# Altium project ControlBoard.PrjPCB
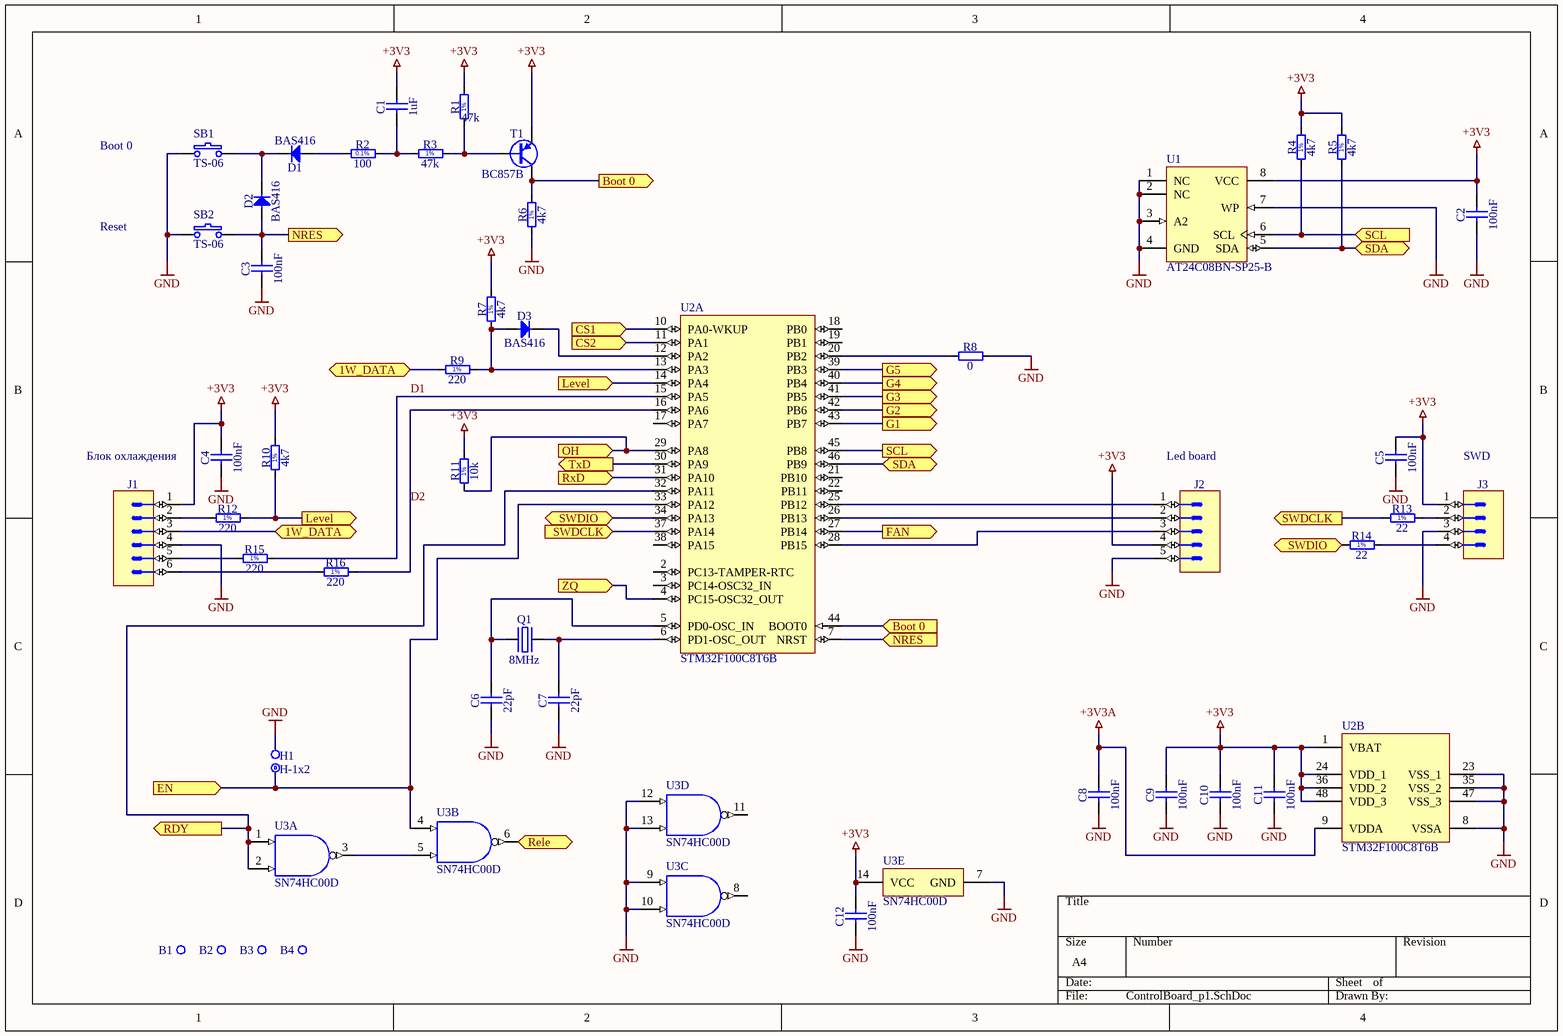
[diagram p0: ControlBoard_p1.SchDoc]
2 sheets, 117 parts. Net scope: flat (ports and power ports of the same name join across sheets).
Board file: PM_CPUBoard_pcb.PcbDoc
Sheets:
  ControlBoard_p1.SchDoc
  ControlBoard_p2.SchDoc

## Sheet ControlBoard_p1.SchDoc
size A4

### Parts
B1  Plated Hole  [MTG350_650]  (value not drawn)
B2  Plated Hole  [MTG350_650]  (value not drawn)
B3  Plated Hole  [MTG350_650]  (value not drawn)
B4  Plated Hole  [MTG350_650]  (value not drawn)
C1  1uF  [CAPC2012X140N]
C2  100nF  [CAPC2012X135N]
C3  100nF  [CAPC2012X135N]
C4  100nF  [CAPC2012X135N]
C5  100nF  [CAPC2012X135N]
C6  22pF  [CAPC2012X135N]
C7  22pF  [CAPC2012X135N]
C8  100nF  [CAPC2012X135N]
C9  100nF  [CAPC2012X135N]
C10  100nF  [CAPC2012X135N]
C11  100nF  [CAPC2012X135N]
C12  100nF  [CAPC2012X135N]
D1  BAS416  [SOD2512X110N]
D2  BAS416  [SOD2512X110N]
D3  BAS416  [SOD2512X110N]
H1  H-1x2  [J1x2]
J1  KK®  [MOLEX_22-27-2061]  (value not drawn)
J2  KK®  [MOLEX_22-27-2051]  (value not drawn)
J3  KK®  [MOLEX_22-27-2041]  (value not drawn)
Q1  8MHz  [XTAL_HC-49/U-S]
R1  47k  [RESC2012X60N]
R2  100  [RESC2012X60N]
R3  47k  [RESC2012X60N]
R4  4k7  [RESC2012X60N]
R5  4k7  [RESC2012X60N]
R6  4k7  [RESC2012X60N]
R7  4k7  [RESC2012X60N]
R8  0  [RESC2012X60N]
R9  220  [RESC2012X60N]
R10  4k7  [RESC2012X60N]
R11  10k  [RESC2012X60N]
R12  220  [RESC2012X60N]
R13  22  [RESC2012X60N]
R14  22  [RESC2012X60N]
R15  220  [RESC2012X60N]
R16  220  [RESC2012X60N]
SB1  TS-06  [TS-06]
SB2  TS-06  [TS-06]
T1  BC857B  [SOT95P230X110-3N]
U1  AT24C08BN-SP25-B  [8S1_N]
U2  STM32F100C8T6B  [STM-LQFP48_N]  (parts A,B of 2)
U3  SN74HC00D  [D0014A_N]  (parts A,B,C,D,E of 5)

### Ports
1W_DATA (bidir), Boot 0 (in), Boot 0 (out), CS1 (in), CS2 (in), EN (in), FAN (out), G1 (out), G2 (out), G3 (out), G4 (out), G5 (out), Level (in), Level (out), NRES (in), NRES (out), OH (in), RDY (out), Rele (out), RxD (in), SCL (in), SCL (out), SDA (bidir), SWDCLK (in), SWDCLK (out), SWDIO (bidir), TxD (out), ZQ (in)

### Nets
+3V3: C1.2 C2.2 C4.2 C5.2 C9.2 C10.2 C11.2 C12.2 J1.1 J2.4 J3.1 R1.2 R4.2 R5.2 R7.2 R10.2 R11.2 T1.2(E) U1.8(VCC) U2.1(VBAT) U2.24(VDD_1) U2.36(VDD_2) U2.48(VDD_3) U3.14(VCC)
+3V3A: C8.2 U2.9(VDDA)
GND: C2.1 C3.1 C4.1 C5.1 C6.1 C7.1 C8.1 C9.1 C10.1 C11.1 C12.1 H1.2 J1.4 J2.5 J3.3 R6.1 R8.2 SB1.1 SB2.1 U1.1(NC) U1.2(NC) U1.3(A2) U1.4(GND) U1.7(WP) U2.8(VSSA) U2.23(VSS_1) U2.35(VSS_2) U2.47(VSS_3) U3.7(GND) U3.9(3A) U3.10(3B) U3.12(4A) U3.13(4B)
D1: R15.2 U2.15(PA5)
D2: R16.2 U2.16(PA6)
NetC1_1: C1.1 R2.2 R3.1
NetC3_2: C3.2 D2.2(A) SB2.2 U2.7(NRST) ; port NRES
NetC6_2: C6.2 Q1.1(OSC1) U2.5(PD0-OSC_IN)
NetC7_2: C7.2 Q1.2(OSC2) U2.6(PD1-OSC_OUT)
NetC25_2: U2.11(PA1) ; port CS2
NetC26_2: U2.10(PA0-WKUP) ; port CS1
NetC29_2: U2.31(PA10) ; port RxD
NetC29_3: U2.30(PA9) ; port TxD
NetD1_1: D1.1(C) D2.1(C) SB1.2
NetD1_2: D1.2(A) R2.1
NetD3_1: D3.1(C) U2.12(PA2)
NetD3_2: D3.2(A) R7.1 R9.2 U2.13(PA3)
NetDA1_4: H1.1 U2.33(PA12) U3.4(2A) ; port EN
NetIC2_5: U2.4(PC15-OSC32_OUT) ; port ZQ
NetJ1_2: J1.2 R12.1
NetJ1_3: J1.3 R9.1 ; port 1W_DATA
NetJ1_5: J1.5 R15.1
NetJ1_6: J1.6 R16.1
NetJ2_1: J2.1 U2.25(PB12)
NetJ2_2: J2.2 U2.26(PB13)
NetJ2_3: J2.3 U2.28(PB15)
NetJ3_2: J3.2 R13.2
NetJ3_4: J3.4 R14.2
NetJ4_8: R11.1 U2.29(PA8) ; port OH
NetLD1_2: U2.43(PB7) ; port G1
NetLD2_2: U2.42(PB6) ; port G2
NetLD3_2: U2.41(PB5) ; port G3
NetLD4_2: U2.40(PB4) ; port G4
NetLD5_2: U2.39(PB3) ; port G5
NetR1_1: R1.1 R3.2 T1.1(B)
NetR4_1: R4.1 U1.6(SCL) U2.45(PB8) ; port SCL
NetR5_1: R5.1 U1.5(SDA) U2.46(PB9) ; port SDA
NetR6_2: R6.2 T1.3(C) U2.44(BOOT0) ; port Boot 0
NetR8_1: R8.1 U2.20(PB2)
NetR10_1: R10.1 R12.2 U2.14(PA4) ; port Level
NetR13_1: R13.1 U2.37(PA14) ; port SWDCLK
NetR14_1: R14.1 U2.34(PA13) ; port SWDIO
NetR22_2: U2.27(PB14) ; port FAN
NetR23_2: U3.6(2Y) ; port Rele
NetR39_2: U2.32(PA11) U3.1(1A) U3.2(1B) ; port RDY
NetU3_3: U3.3(1Y) U3.5(2B)

Not connected (* = marked no-connect by the designer): B1 1; B2 1; B3 1; B4 1; U2 2(PC13-TAMPER-RTC) 3(PC14-OSC32_IN) 17(PA7) 18(PB0) 19(PB1) 21(PB10) 22(PB11) 38(PA15); U3 8(3Y) 11(4Y)

### Notes on the sheet
- Boot 0
- Reset
- Блок охлаждения
- (near J2) Led board
- (near J3) SWD
- (in symbol R0805_4K7_1%_0.125W_100PPM) 1%
- (in symbol R0805_10K_1%_0.125W_100PPM) 1%
- (in symbol R0805_22R_1%_0.125W_100PPM) 1%
- (in symbol R0805_47K_1%_0.125W_100PPM) 1%
- (in symbol R0805_100R_0.1%_0.1W_10PPM) 0.1%
- (in symbol R0805_220R_1%_0.125W_100PPM) 1%

### Library data of the parts
B1-B4 = PLATED_HOLE3.5_PAD6.5: Single Terminal Socket; Part Description: Plated Through Hole: Hole Dia.=3.5mm Pad Dia.=6.5mm; Mounted: No; Table: Pads; Part Number: PLATED_HOLE3.5_PAD6.5; Component Kind: Standard (No BOM); Component Type: Standard (No BOM); Pin Count: 1; Family: Plated Hole; Socket: No; SMD: No; Status: None; ComponentHeight: 0mm; Author: CERN DEM JLC; CreateDate: 20.11.2008; LatestRevisionDate: 23.11.2011; PackageDescription: Plated Through Hole: Hole Dia.=3.5mm Pad Dia.=6.5mm
C1 = CC0805_1UF_35V_20%_X7R: Non-polarised capacitor; Part Description: SMD Multilayer Chip Ceramic Capacitor; Manufacturer: GENERIC; Manufacturer1 Part Number: GMK212B7105MG-T; Voltage: 35V; TC: X7R; Tolerance: ±20%; Table: Capacitors SMD; Part Number: CC0805_1UF_35V_20%_X7R; Component Kind: Standard; Component Type: Standard; Pin Count: 2; Value: 1uF; Status: Not Recommended; Manufacturer Part Number: CC0805_1UF_35V_20%_X7R; Case: 0805; Mounted: Yes; Socket: No; SMD: Yes; Manufacturer1 Example: TAIYO YUDEN; Manufacturer1 ComponentHeight: 1.35mm; HelpURL: \\cern.ch\dfs\Applications\Altium\Datasheets\CC0805_X7R_TAIYO-YUDEN_HIGH-VALUE.pdf; Author: CERN DEM JLC; CreateDate: 22.06.2011; LatestRevisionDate: 22.06.2011
C2-C5 C8-C12 = CC0805_100NF_50V_10%_X7R: Non-polarised capacitor; Part Description: SMD Multilayer Chip Ceramic Capacitor; Manufacturer: GENERIC; Manufacturer1 Part Number: B37941K5104K62; Voltage: 50V; TC: X7R; Tolerance: ±10%; Table: Capacitors SMD; Part Number: CC0805_100NF_50V_10%_X7R; Component Kind: Standard; Component Type: Standard; Pin Count: 2; Value: 100nF; Status: Preferred; Manufacturer Part Number: CC0805_100NF_50V_10%_X7R; Case: 0805; Mounted: Yes; Socket: No; SMD: Yes; Manufacturer1 Example: EPCOS; Manufacturer1 ComponentHeight: 1.35mm; HelpURL: \\cern.ch\dfs\Applications\Altium\Datasheets\CC0805_X7R_EPCOS.pdf; Author: CERN DEM JLC; CreateDate: 03.12.2007; LatestRevisionDate: 03.12.2007
C6 C7 = CC0805_22PF_50V_5%_NP0: Non-polarised capacitor; Part Description: SMD Multilayer Chip Ceramic Capacitor; Manufacturer: GENERIC; Manufacturer1 Part Number: 223886115229; Voltage: 50V; TC: NP0; Tolerance: ±5%; Table: Capacitors SMD; Part Number: CC0805_22PF_50V_5%_NP0; Component Kind: Standard; Component Type: Standard; Pin Count: 2; Value: 22pF; Status: Preferred; Manufacturer Part Number: CC0805_22PF_50V_5%_NP0; Case: 0805; Mounted: Yes; Socket: No; SMD: Yes; Manufacturer1 Example: PHYCOMP; Manufacturer1 ComponentHeight: 1.35mm; HelpURL: \\cern.ch\dfs\Applications\Altium\Datasheets\CC0805_NP0_PHYCOMP.pdf; Author: CERN DEM JLC; CreateDate: 03.12.2007; LatestRevisionDate: 03.12.2007
D1-D3 = BAS416: Diode; Part Description: Low-Leakage Diode; Manufacturer: NXP SEMICONDUCTORS; Voltage: 75V; Power: 200mA; Table: Diodes; Part Number: BAS416; Component Kind: Standard; Component Type: Standard; Device: BAS416; PackageDescription: Small Outline Diode Flat Lead (SOD-323), 1.70mm W X 1.25mm L X 1.10mm H body,  IPC Medium Density; Manufacturer Part Number: BAS416; Pin Count: 2; Case: SOD323; Mounted: Yes; Socket: No; SMD: Yes; ComponentHeight: 1.1mm; HelpURL: \\cern.ch\dfs\Applications\Altium\Datasheets\BAS416.pdf; Author: CERN DEM JLC; CreateDate: 01.10.2013; LatestRevisionDate: 01.10.2013
J1 = MOLEX_22-27-2061: Connector 6 Male; Part Description: 2.54mm (.100") Pitch KK® Wire-to-Board Header, Vertical, with Friction Lock, 6 Circuits, Tin (Sn) Plating; Manufacturer: MOLEX; Part Number: MOLEX_22-27-2061; Component Kind: Standard; Component Type: Standard; Pin Count: 6; Family: KK®; Mounted: Yes; Socket: No; SMD: No; Status: None; Manufacturer Part Number: 22-27-2061; ComponentHeight: 11.7mm; HelpURL: \\cern.ch\dfs\Applications\Altium\Datasheets\MOLEX_22-27-2061.pdf; Author: CERN DEM JMW; CreateDate: 30.11.2011; LatestRevisionDate: 30.11.2011; Table: MOLEX
J2 = MOLEX_22-27-2051: Connector 5 Male; Part Description: 2.54mm (.100") Pitch KK® Wire-to-Board Header, Vertical, with Friction Lock, 5 Circuits, Tin (Sn) Plating; Manufacturer: MOLEX; Part Number: MOLEX_22-27-2051; Component Kind: Standard; Component Type: Standard; Pin Count: 5; Family: KK®; Mounted: Yes; Socket: No; SMD: No; Status: None; Manufacturer Part Number: 22-27-2051; ComponentHeight: 11.7mm; HelpURL: \\cern.ch\dfs\Applications\Altium\Datasheets\MOLEX_22-27-2051.pdf; Author: CERN DEM JLC; CreateDate: 04.12.2008; LatestRevisionDate: 04.12.2008; Table: MOLEX
J3 = MOLEX_22-27-2041: Connector 4 Male; Part Description: 2.54mm (.100") Pitch KK® Wire-to-Board Header, Vertical, with Friction Lock, 4 Circuits, Tin (Sn) Plating; Manufacturer: MOLEX; Part Number: MOLEX_22-27-2041; Component Kind: Standard; Component Type: Standard; Pin Count: 4; Family: KK®; Mounted: Yes; Socket: No; SMD: No; Status: None; Manufacturer Part Number: 22-27-2041; ComponentHeight: 11.7mm; HelpURL: \\cern.ch\dfs\Applications\Altium\Datasheets\MOLEX_22-27-2041.pdf; Author: CERN DEM JLC; CreateDate: 04.12.2008; LatestRevisionDate: 04.12.2008; Table: MOLEX
Q1 = XTAL_5MHZ_CITIZEN_HC49US5.000MABJ-UB: Quartz Crystal; Part Description: Tolerance:± 30ppm, Stability:± 50ppm, -10°C to +60°C, 18pF, Quartz Crystal, HC-49/U-S Serie; Manufacturer: CITIZEN FINETECH MIYOTA CO; Table: Crystals & Oscillators; Part Number: XTAL_5MHZ_CITIZEN_HC49US5.000MABJ-UB; Component Kind: Standard; Component Type: Standard; PackageDescription: HC-49/U-S Leaded Cristal, Body 11.5x4.66mm; Pitch 4.88mm; Value: 8MHz; Manufacturer Part Number: HC49US5.000MABJ-UB; Pin Count: 2; Mounted: Yes; Socket: No; SMD: No; ComponentHeight: 3.5mm; HelpURL: \\cern.ch\dfs\Applications\Altium\Datasheets\XTAL_CITIZEN_HC-49-U-S.pdf; Author: CERN DEM JLC; CreateDate: 27.11.2012; LatestRevisionDate: 27.11.2012
R1 R3 = R0805_47K_1%_0.125W_100PPM: Resistor - 1%; Part Description: General Purpose Thick Film Chip Resistor; Manufacturer: GENERIC; Manufacturer1 Part Number: NRC10F4702TRF; Power: 0.125W; TC: ±100ppm/°C; Table: Resistors SMD; Part Number: R0805_47K_1%_0.125W_100PPM; Component Kind: Standard; Component Type: Standard; Pin Count: 2; Value: 47k; Status: Preferred; Tolerance: ±1%; Manufacturer Part Number: R0805_47K_1%_0.125W_100PPM; Case: 0805; Mounted: Yes; Socket: No; SMD: Yes; Manufacturer1 Example: NIC COMPONENT; Manufacturer1 ComponentHeight: 0.6mm; HelpURL: \\cern.ch\dfs\Applications\Altium\Datasheets\R0805_NIC_NRC.pdf; Author: CERN DEM JLC; CreateDate: 03.12.2007; LatestRevisionDate: 13.03.2008
R2 = R0805_100R_0.1%_0.1W_10PPM: Resistor - 0.1%; Part Description: Thin Film Chip Resistor; Manufacturer: GENERIC; Manufacturer1 Part Number: RN73C2A100RBTG; Power: 0.1W; TC: ±10ppm; Table: Resistors SMD; Part Number: R0805_100R_0.1%_0.1W_10PPM; Component Kind: Standard; Component Type: Standard; Pin Count: 2; Value: 100; Status: Not recommended; Tolerance: ±0.1%; Manufacturer Part Number: R0805_100R_0.1%_0.1W_10PPM; Case: 0805; Mounted: Yes; Socket: No; SMD: Yes; Manufacturer1 Example: TYCO HOLSWORTHY; Manufacturer1 ComponentHeight: 0.6mm; HelpURL: \\cern.ch\dfs\Applications\Altium\Datasheets\R0805_Tyco_RN73.pdf; Author: CERN DEM JLC; CreateDate: 03.12.2007; LatestRevisionDate: 13.03.2008
R4-R7 R10 = R0805_4K7_1%_0.125W_100PPM: Resistor - 1%; Part Description: General Purpose Thick Film Chip Resistor; Manufacturer: GENERIC; Manufacturer1 Part Number: NRC10F4701TRF; Power: 0.125W; TC: ±100ppm/°C; Table: Resistors SMD; Part Number: R0805_4K7_1%_0.125W_100PPM; Component Kind: Standard; Component Type: Standard; Pin Count: 2; Value: 4k7; Status: Preferred; Tolerance: ±1%; Manufacturer Part Number: R0805_4K7_1%_0.125W_100PPM; Case: 0805; Mounted: Yes; Socket: No; SMD: Yes; Manufacturer1 Example: NIC COMPONENT; Manufacturer1 ComponentHeight: 0.6mm; HelpURL: \\cern.ch\dfs\Applications\Altium\Datasheets\R0805_NIC_NRC.pdf; Author: CERN DEM JLC; CreateDate: 03.12.2007; LatestRevisionDate: 13.03.2008
R8 = R0805_0R_JUMPER: Resistor; Part Description: 2A (0.05R Max DC Resistance) Zero Ohm Jumper; Manufacturer: GENERIC; Manufacturer1 Part Number: NRC10Z0; Table: Resistors SMD; Part Number: R0805_0R_JUMPER; Component Kind: Standard; Component Type: Standard; Pin Count: 2; Value: 0; Status: Preferred; Manufacturer Part Number: R0805_0R_JUMPER; Case: 0805; Mounted: Yes; Socket: No; SMD: Yes; Manufacturer1 Example: NIC COMPONENT; Manufacturer1 ComponentHeight: 0.6mm; HelpURL: \\cern.ch\dfs\Applications\Altium\Datasheets\R0805_NIC_NRC.pdf; Author: CERN DEM JLC; CreateDate: 03.12.2007; LatestRevisionDate: 13.03.2008
R9 R12 R15 R16 = R0805_220R_1%_0.125W_100PPM: Resistor - 1%; Part Description: General Purpose Thick Film Chip Resistor; Manufacturer: GENERIC; Manufacturer1 Part Number: NRC10F2200TRF; Power: 0.125W; TC: ±100ppm/°C; Table: Resistors SMD; Part Number: R0805_220R_1%_0.125W_100PPM; Component Kind: Standard; Component Type: Standard; Pin Count: 2; Value: 220; Status: Preferred; Tolerance: ±1%; Manufacturer Part Number: R0805_220R_1%_0.125W_100PPM; Case: 0805; Mounted: Yes; Socket: No; SMD: Yes; Manufacturer1 Example: NIC COMPONENT; Manufacturer1 ComponentHeight: 0.6mm; HelpURL: \\cern.ch\dfs\Applications\Altium\Datasheets\R0805_NIC_NRC.pdf; Author: CERN DEM JLC; CreateDate: 03.12.2007; LatestRevisionDate: 13.03.2008
R11 = R0805_10K_1%_0.125W_100PPM: Resistor - 1%; Part Description: General Purpose Thick Film Chip Resistor; Manufacturer: GENERIC; Manufacturer1 Part Number: NRC10F1002TRF; Power: 0.125W; TC: ±100ppm/°C; Table: Resistors SMD; Part Number: R0805_10K_1%_0.125W_100PPM; Component Kind: Standard; Component Type: Standard; Pin Count: 2; Value: 10k; Status: Preferred; Tolerance: ±1%; Manufacturer Part Number: R0805_10K_1%_0.125W_100PPM; Case: 0805; Mounted: Yes; Socket: No; SMD: Yes; Manufacturer1 Example: NIC COMPONENT; Manufacturer1 ComponentHeight: 0.6mm; HelpURL: \\cern.ch\dfs\Applications\Altium\Datasheets\R0805_NIC_NRC.pdf; Author: CERN DEM JLC; CreateDate: 03.12.2007; LatestRevisionDate: 13.03.2008
R13 R14 = R0805_22R_1%_0.125W_100PPM: Resistor - 1%; Part Description: General Purpose Thick Film Chip Resistor; Manufacturer: GENERIC; Manufacturer1 Part Number: NRC10F22R0TRF; Power: 0.125W; TC: ±100ppm/°C; Table: Resistors SMD; Part Number: R0805_22R_1%_0.125W_100PPM; Component Kind: Standard; Component Type: Standard; Pin Count: 2; Value: 22; Status: Preferred; Tolerance: ±1%; Manufacturer Part Number: R0805_22R_1%_0.125W_100PPM; Case: 0805; Mounted: Yes; Socket: No; SMD: Yes; Manufacturer1 Example: NIC COMPONENT; Manufacturer1 ComponentHeight: 0.6mm; HelpURL: \\cern.ch\dfs\Applications\Altium\Datasheets\R0805_NIC_NRC.pdf; Author: CERN DEM JLC; CreateDate: 03.12.2007; LatestRevisionDate: 13.03.2008
SB1 SB2 = Buton TS-06: Price: 0.15
T1 = BC857B: PNP Transistor; Part Description: 45V 100mA PNP general-purpose transistors; Manufacturer: NXP SEMICONDUCTORS; Table: Transistors; Part Number: BC857B; Component Kind: Standard; Component Type: Standard; Device: BC857B; PackageDescription: SOT23, 3 pin, Pitch 0.95mm - 1.3mm W X 2.9mm L X 1.1mm H, IPC Medium Density; Manufacturer Part Number: BC857B; Pin Count: 3; Case: SOT23-3; Mounted: Yes; Socket: No; SMD: Yes; ComponentHeight: 1.1mm; HelpURL: \\cern.ch\dfs\Applications\Altium\Datasheets\BC857B.pdf; Author: CERN DEM JLC; CreateDate: 14.06.2011; LatestRevisionDate: 14.06.2011
U1 = AT24C08BN-SP25-B: 8Kbit (1024 x 8), 2-wire Bus Automotive Serial EEPROM with Write Protect, 2.5V, 8-Pin SOIC, Bulk; DatasheetVersion: 8517C,  Jan-2009; PackageVersion: revC, Mar-2005; PackageReference: 8S1; PackageDescription: 8-Lead (0.150" Wide Body), Plastic Gull Wing Small Outline (JEDEC SOIC); Code_JEDEC: MS-012-AA; Code_IPC: SOIC127P600-8; ComponentLink1Description: Manufacturer URL; ComponentLink1URL: http://www.atmel.com/; ComponentLink2Description: Datasheet; ComponentLink2URL: http://www.atmel.com/dyn/resources/prod_documents/doc8517.pdf
U2 = STM32F100C8T6B: ARM Cortex-M3 32-bit MCU, 64 KB Flash, 8 KB Internal RAM, 37 I/Os, 48-pin LQFP, -40 to 85 degC, Tray; A/D Converter: 1x12-bit (10 Channel); D/A Converter: 2x12-bit (2 Channel); FLASH Size (Prog) (kB): 64; I/Os (High Current): 37; Internal RAM Size (kB): 8; Operating Frequency(F) (Processor speed) (MHz): 24; Supply Voltage(Vcc) min (V): 2; DatasheetVersion: Rev. 7; PackageVersion: Rev. 6, 06/2013; PackageReference: LQFP48; PackageDescription: 48-Pin Low Profile Quad Flat Package, 7 x 7 mm Body, 0.5 mm Pitch; Supplier 1: Digi-Key; Supplier Part Number 1: 497-10499-ND; Supplier 2: Farnell; Supplier Part Number 2: 1838511; Supplier 3: Newark; Supplier Part Number 3: 76R0988; Supplier 4: Mouser; Supplier Part Number 4: 511-STM32F100C8T6B; Core: ARM Cortex-M3; Packing: Tray; Mounting Technology: Surface Mount; PartNumber: STM32F100C8T6B; ComponentLink1Description: Manufacturer URL; ComponentLink1URL: http://www.st.com/web/en/home.html; ComponentLink2Description: Datasheet; ComponentLink2URL: http://www.st.com/st-web-ui/static/active/en/resource/technical/document/datasheet/CD00251732.pdf; ComponentLink3Description: Package Specification; ComponentLink3URL: http://www.st.com/st-web-ui/static/active/en/resource/technical/document/datasheet/DM00058181.pdf
U3 = SN74HC00D: Quad 2-Input Positive-NAND Gates, D0014A, TUBE; Manufacturer: Texas Instruments; VCC(Min)(V): 2; VCC(Max)(V): 6; Output Type: CMOS; ICC @ Nom Voltage(Max)(mA): 0.02; Bits(#): 4; F @ Nom Voltage(Max)(Mhz): 70; Rating: Catalog; Technology Family: HC; Voltage(Nom)(V): 5; Schmitt Trigger: Yes; Output Drive (IOL/IOH)(Max)(mA): 5.2/-5.2; tpd @ Nom Voltage(Max)(ns): 23; DatasheetVersion: SCLS181E; PackageReference: D0014A; Supplier 1: Mouser; Supplier Part Number 1: 595-SN74HC00D; Supplier 2: Digi-Key; Supplier Part Number 2: 296-1187-5-ND; Generic Part Number: SN74HC00; Input Type: CMOS; Operating Temperature Range(C): -40 to 85; Code_JEDEC: MS-012; PartNumber: SN74HC00D; ComponentLink1Description: Manufacturer URL; ComponentLink1URL: http://www.ti.com/; ComponentLink2Description: Datasheet; ComponentLink2URL: http://www.ti.com/lit/ds/symlink/sn74hc00.pdf; ComponentLink3Description: Package Specification; ComponentLink3URL: http://www.ti.com/lit/ml/mpds177g/mpds177g.pdf
H1 = H-1x2: Price: 0.02

## Sheet ControlBoard_p2.SchDoc
size A4
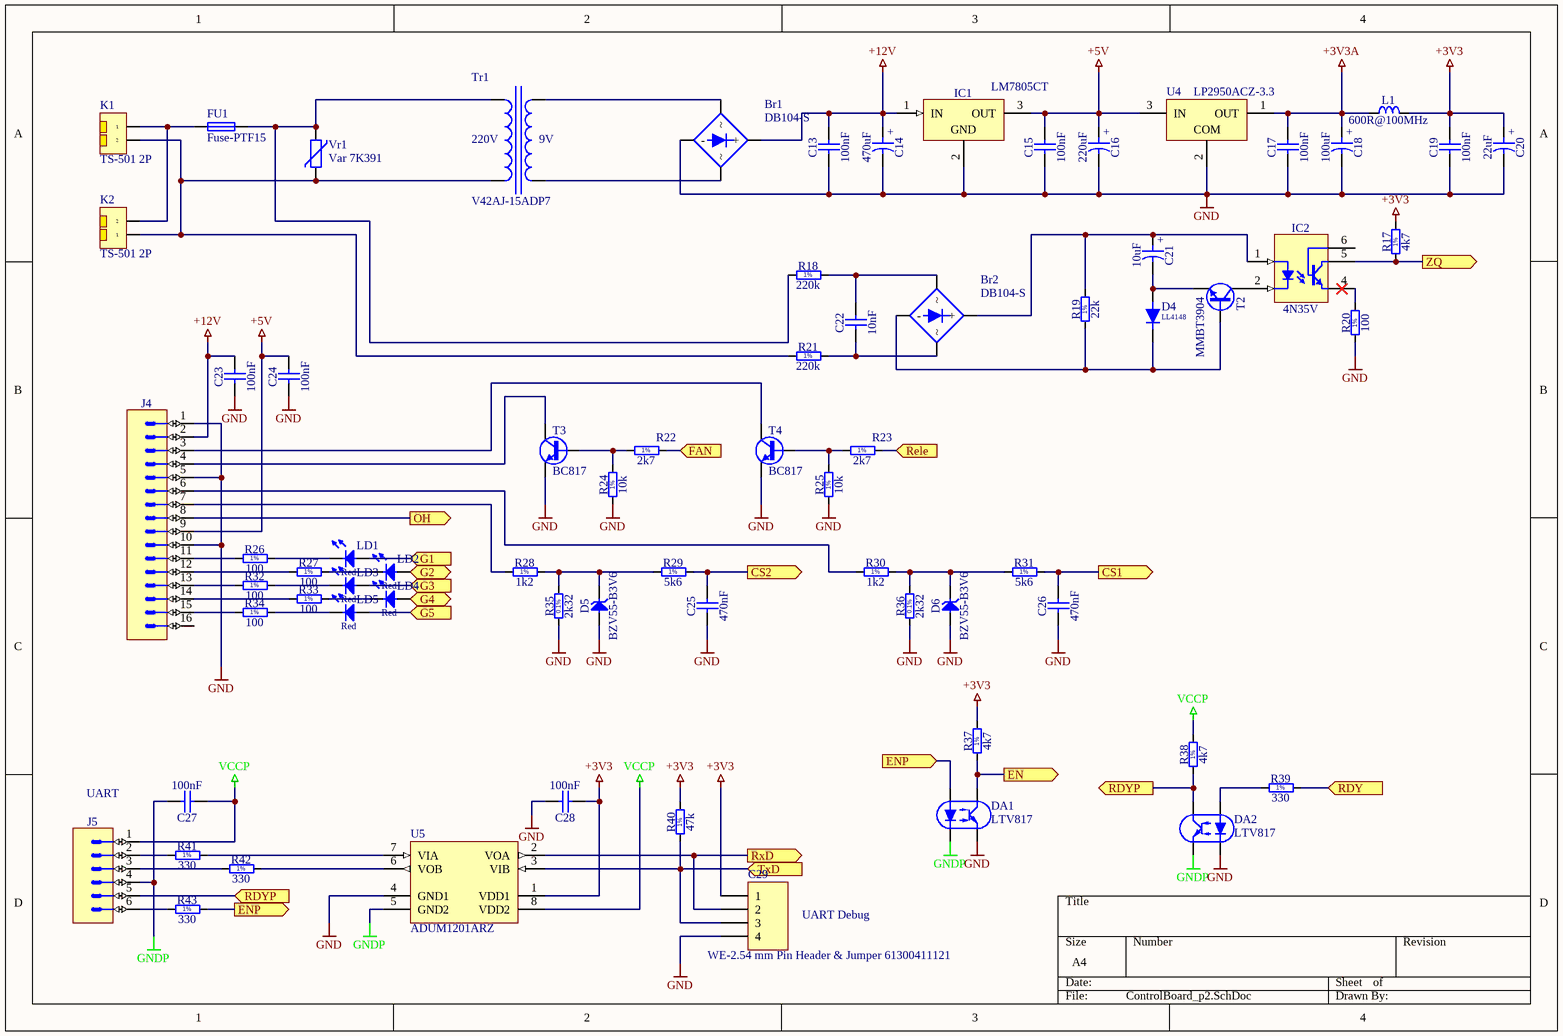
[diagram p1: ControlBoard_p2.SchDoc]

### Parts
Br1  DB104-S  [DB-S]
Br2  DB104-S  [DB-S]
C13  100nF  [CAPC2012X135N]
C14  470uF  [CAPPR500-1050X2200]
C15  100nF  [CAPC2012X135N]
C16  220uF  [CAPPR350-850X1300]
C17  100nF  [CAPC2012X135N]
C18  100uF  [CAPPR350-850X800]
C19  100nF  [CAPC2012X135N]
C20  22uF  [CAPPRB254-600X990]
C21  10uF  [CAPPR200-500X1100]
C22  10nF  [CAPR500-300X720X650]
C23  100nF  [CAPC2012X135N]
C24  100nF  [CAPC2012X135N]
C25  470nF  [CAPC2012X110N]
C26  470nF  [CAPC2012X110N]
C27  100nF  [CAPC2012X135N]
C28  100nF  [CAPC2012X135N]
C29  WE-2.54 mm Pin Header & Jumper 61300411121  [61300411121]
D4  LL4148  [SOD80/MLL34]
D5  BZV55-B3V6  [DIOMELF3515N]
D6  BZV55-B3V6  [DIOMELF3515N]
DA1  LTV817  [DIL4-300a]
DA2  LTV817  [DIL4-300a]
FU1  Fuse-PTF15  [FUSE-MCH]
IC1  LM7805CT  [TO-220-V]
IC2  4N35V  [DIP6-300]
J4  Header 16  [3M_N2516-6002RB]  (value not drawn)
J5  KK®  [MOLEX_22-27-2061]  (value not drawn)
K1  TS-501 2P  [TS-501 2P-2.5]
K2  TS-501 2P  [TS-501 2P-2.5]
L1  600R@100MHz  [INDC2012X110N]
LD1  Super Red  [LED_OSRAM_LSR976]  (value not drawn)
LD2  Super Red  [LED_OSRAM_LSR976]  (value not drawn)
LD3  Super Red  [LED_OSRAM_LSR976]  (value not drawn)
LD4  Super Red  [LED_OSRAM_LSR976]  (value not drawn)
LD5  Super Red  [LED_OSRAM_LSR976]  (value not drawn)
R17  4k7  [RESC2012X60N]
R18  220k  [RES1016-630X250]
R19  22k  [RESC2012X60N]
R20  100  [RESC2012X60N]
R21  220k  [RES1016-630X250]
R22  2k7  [RESC2012X60N]
R23  2k7  [RESC2012X60N]
R24  10k  [RESC2012X60N]
R25  10k  [RESC2012X60N]
R26  100  [RESC2012X60N]
R27  100  [RESC2012X60N]
R28  1k2  [RESC2012X60N]
R29  5k6  [RESC2012X60N]
R30  1k2  [RESC2012X60N]
R31  5k6  [RESC2012X60N]
R32  100  [RESC2012X60N]
R33  100  [RESC2012X60N]
R34  100  [RESC2012X60N]
R35  2k32  [RESC2012X60N]
R36  2k32  [RESC2012X60N]
R37  4k7  [RESC2012X60N]
R38  4k7  [RESC2012X60N]
R39  330  [RESC2012X60N]
R40  47k  [RESC2012X60N]
R41  330  [RESC2012X60N]
R42  330  [RESC2012X60N]
R43  330  [RESC2012X60N]
T2  MMBT3904  [SOT95P230X110-3N]
T3  BC817  [SOT95P230X110-3N]
T4  BC817  [SOT95P230X110-3N]
Tr1  V42AJ-15ADP7  [TR220-6W]
U4  LP2950ACZ-3.3  [LP3]
U5  ADUM1201ARZ  [ADI-R-8_N]
Vr1  Var 7K391  [VAR-7K-200]

### Ports
CS1 (out), CS2 (out), EN (out), ENP (in), ENP (out), FAN (in), G1 (in), G2 (in), G3 (in), G4 (in), G5 (in), OH (out), RDY (in), RDYP (in), RDYP (out), Rele (in), RxD (out), TxD (in), ZQ (out)

### Nets
+3V3: C19.2 C20.1 C28.1 C29.1 L1.2 R17.2 R37.2 R40.2 U5.1(VDD1)
+3V3A: C17.2 C18.1 L1.1 U4.1(OUT)
+5V: C15.2 C16.1 C24.2 IC1.3(OUT) J4.9 U4.3(IN)
+12V: Br1.1(+) C13.2 C14.1 C23.2 IC1.1(IN) J4.2
GND: Br1.2(-) C13.1 C14.2 C15.1 C16.2 C17.1 C18.2 C19.1 C20.2 C23.1 C24.1 C25.1 C26.1 C28.2 C29.4 D5.2(A) D6.2(A) DA1.3(E) DA2.2(C) IC1.2(GND) J4.1 J4.5 J4.10 R20.1 R24.1 R25.1 R35.1 R36.1 T3.2(E) T4.2(E) U4.2(COM) U5.4(GND1)
GNDP: C27.2 DA1.2(C) DA2.3(E) J5.4 U5.5(GND2)
VCCP: C27.1 J5.1 R38.2 U5.8(VDD2)
NetBr1_3: Br1.3 Tr1.9
NetBr1_4: Br1.4 Tr1.7
NetBr2_1: Br2.1(+) C21.1 IC2.1(A) R19.2
NetBr2_2: Br2.2(-) D4.2(C) R19.1 T2.1(B)
NetBr2_3: Br2.3 C22.2 R18.2
NetBr2_4: Br2.4 C22.1 R21.2
NetC21_2: C21.2 D4.1(A) T2.2(E)
NetC25_2: C25.2 R29.2 ; port CS2
NetC26_2: C26.2 R31.2 ; port CS1
NetC29_2: C29.2 U5.2(VOA) ; port RxD
NetC29_3: C29.3 R40.1 U5.3(VIB) ; port TxD
NetD5_1: D5.1(C) R28.2 R29.1 R35.2
NetD6_1: D6.1(C) R30.2 R31.1 R36.2
NetDA1_1: DA1.1(A) R43.2 ; port ENP
NetDA1_4: DA1.4(C) R37.1 ; port EN
NetDA2_1: DA2.1(A) R39.1
NetDA2_4: DA2.4(C) J5.5 R38.1 ; port RDYP
NetFU1_1: FU1.1 R18.1 Tr1.1 Vr1.1
NetFU1_2: FU1.2 K1.1 K2.2
NetIC2_2: IC2.2(C) T2.3(C)
NetIC2_4: IC2.4(E) R20.2
NetIC2_5: IC2.5(C) R17.1 ; port ZQ
NetJ4_3: J4.3 T4.3(C)
NetJ4_4: J4.4 T3.3(C)
NetJ4_6: J4.6 R30.1
NetJ4_7: J4.7 R28.1
NetJ4_8: J4.8 ; port OH
NetJ4_11: J4.11 R26.1
NetJ4_12: J4.12 R27.1
NetJ4_13: J4.13 R32.1
NetJ4_14: J4.14 R33.1
NetJ4_15: J4.15 R34.1
NetJ5_2: J5.2 R41.1
NetJ5_3: J5.3 R42.1
NetJ5_6: J5.6 R43.1
NetK1_2: K1.2 K2.1 R21.1 Tr1.5 Vr1.2
NetLD1_1: LD1.1(C) R26.2
NetLD1_2: LD1.2(A) ; port G1
NetLD2_1: LD2.1(C) R27.2
NetLD2_2: LD2.2(A) ; port G2
NetLD3_1: LD3.1(C) R32.2
NetLD3_2: LD3.2(A) ; port G3
NetLD4_1: LD4.1(C) R33.2
NetLD4_2: LD4.2(A) ; port G4
NetLD5_1: LD5.1(C) R34.2
NetLD5_2: LD5.2(A) ; port G5
NetR22_1: R22.1 R24.2 T3.1(B)
NetR22_2: R22.2 ; port FAN
NetR23_1: R23.1 R25.2 T4.1(B)
NetR23_2: R23.2 ; port Rele
NetR39_2: R39.2 ; port RDY
NetR41_2: R41.2 U5.7(VIA)
NetR42_2: R42.2 U5.6(VOB)

Not connected (* = marked no-connect by the designer): IC2 6(C); J4 16

### Notes on the sheet
- (near J5) UART
- UART Debug
- (in symbol CAER_10UF_63V_20%_PANASONIC_ECA1JM100) +
- (in symbol CAER_100UF_25V_20%_RUBYCON_25ML100M8X7) +
- (in symbol CAER_220UF_25V_20%_RUBYCON_25YXF220M8X11.5) +
- (in symbol CAER_470UF_25V_20%_500-1050X2200_LESR0R062) +
- (in symbol CTEB_22UF_16V_10%_254-600X990) +
- (in symbol LED_OSRAM_LSR976) Red
- (in symbol R0805_1K2_1%_0.125W_100PPM) 1%
- (in symbol R0805_2K7_1%_0.125W_100PPM) 1%
- (in symbol R0805_2K32_0.1%_0.1W_10PPM) 0.1%
- (in symbol R0805_4K7_1%_0.125W_100PPM) 1%
- (in symbol R0805_5K6_1%_0.125W_100PPM) 1%
- (in symbol R0805_10K_1%_0.125W_100PPM) 1%
- (in symbol R0805_22K_1%_0.125W_100PPM) 1%
- (in symbol R0805_47K_1%_0.125W_100PPM) 1%
- (in symbol R0805_100R_1%_0.125W_100PPM) 1%
- (in symbol R0805_330R_1%_0.125W_100PPM) 1%
- (in symbol RMF_220K_1%_0.6W_50PPM_1016-630X250) 1%
- (in symbol V42AJ-15ADP7) 220V; 9V

### Library data of the parts
Br1 Br2 = DB104-S: SMD 1A 400V; Price: 0.23
C13 C15 C17 C19 C23 C24 C27 C28 = CC0805_100NF_50V_10%_X7R: as C2 on sheet ControlBoard_p1; Part Number: CC0805_100NF_50V_10%_X7R; Component Kind: Standard; Component Type: Standard; Pin Count: 2; Value: 100nF; Status: Preferred; Manufacturer Part Number: CC0805_100NF_50V_10%_X7R; Case: 0805; Mounted: Yes; Socket: No; SMD: Yes; Manufacturer1 Example: EPCOS; Manufacturer1 ComponentHeight: 1.35mm; HelpURL: \\cern.ch\dfs\Applications\Altium\Datasheets\CC0805_X7R_EPCOS.pdf; Author: CERN DEM JLC; CreateDate: 03.12.2007; LatestRevisionDate: 03.12.2007
C14 = CAER_470UF_25V_20%_500-1050X2200_LESR0R062: Polarised capacitor; Part Description: Low ESR 0R062 Aluminum Electrolytic Capacitor; Manufacturer: VISHAY BCCOMPONENTS; Manufacturer Part Number: MAL213666471E3 Series 136RVI; Voltage: 25V; Tolerance: ±20%; Table: Capacitors THD; Part Number: CAER_470UF_25V_20%_500-1050X2200_LESR0R062; Component Kind: Standard; Component Type: Standard; Pin Count: 2; Value: 470uF; Status: Preferred; Case: LS5 D10.5 x H22; Mounted: Yes; Socket: No; SMD: No; ComponentHeight: 22mm; HelpURL: \\cern.ch\dfs\Applications\Altium\Datasheets\CAER-LESR_VISHAY_136RVI.pdf; Author: CERN DEM JLC; CreateDate: 03.07.2008; LatestRevisionDate: 16.03.2009
C16 = CAER_220UF_25V_20%_RUBYCON_25YXF220M8X11.5: Polarised capacitor; Part Description: Radial Miniature, Aluminum Electrolytic Capacitor, (YXF Series); Voltage: 25V; Tolerance: ±20%; Table: Capacitors THD; Part Number: CAER_220UF_25V_20%_RUBYCON_25YXF220M8X11.5; Component Kind: Standard; Component Type: Standard; Pin Count: 2; Value: 220uF; Status: None; Manufacturer: RUBYCON; Manufacturer Part Number: 25YXF220M8X11.5; Case: LS3.5 D8.5 x H13; Mounted: Yes; Socket: No; SMD: No; ComponentHeight: 13mm; HelpURL: \\cern.ch\dfs\Applications\Altium\Datasheets\CAER_RUBYCON_YXF.pdf; Author: CERN DEM JLC; CreateDate: 20.08.2009; LatestRevisionDate: 17.09.2009
C18 = CAER_100UF_25V_20%_RUBYCON_25ML100M8X7: Polarised capacitor; Part Description: Aluminum Electrolytic Capacitor, (ML Series); Voltage: 25V; Tolerance: ±20%; Table: Capacitors THD; Part Number: CAER_100UF_25V_20%_RUBYCON_25ML100M8X7; Component Kind: Standard; Component Type: Standard; Pin Count: 2; Value: 100uF; Status: None; Manufacturer: RUBYCON; Manufacturer Part Number: 25ML100M8X7; Case: LS3.5 D8.5 x H8; Mounted: Yes; Socket: No; SMD: No; ComponentHeight: 8mm; HelpURL: \\cern.ch\dfs\Applications\Altium\Datasheets\CAER_RUBYCON_25ML100M8X7.pdf; Author: CERN DEM JMW; CreateDate: 17.11.2008; LatestRevisionDate: 08.05.2013
C20 = CTEB_22UF_16V_10%_254-600X990: Polarised capacitor; Part Description: Solid Tantalum Resin Dipped Capacitor; Manufacturer: KEMET; Manufacturer Part Number: T350F226K016AT; Voltage: 16V; Tolerance: ±10%; Table: Capacitors THD; Part Number: CTEB_22UF_16V_10%_254-600X990; Component Kind: Standard; Component Type: Standard; Pin Count: 2; Value: 22uF; Status: None; Case: LS2.54 D6 x H9.9; Mounted: Yes; Socket: No; SMD: No; ComponentHeight: 9.9mm; HelpURL: \\cern.ch\dfs\Applications\Altium\Datasheets\CTEB_KEMET_T350.pdf; Author: CERN DEM JLC; CreateDate: 16.12.2009; LatestRevisionDate: 16.12.2009
C21 = CAER_10UF_63V_20%_PANASONIC_ECA1JM100: Polarised capacitor; Part Description: Aluminum Electrolytic Capacitor (Series: M Type: A); Voltage: 63V; Tolerance: ±20%; Table: Capacitors THD; Part Number: CAER_10UF_63V_20%_PANASONIC_ECA1JM100; Component Kind: Standard; Component Type: Standard; Pin Count: 2; Value: 10uF; Status: None; Manufacturer: PANASONIC; Manufacturer Part Number: ECA1JM100; Case: LS2 D5 x H11; Mounted: Yes; Socket: No; SMD: No; ComponentHeight: 11mm; HelpURL: \\cern.ch\dfs\Applications\Altium\Datasheets\CAER_PANASONIC_M.pdf; Author: CERN DEM JLC; CreateDate: 04.03.2009; LatestRevisionDate: 04.03.2009
C22 = CPER_10NF_400V_10%_500-300X720X650: Non-polarised capacitor; Part Description: Metallized Polyester Film Capacitor (MKT); Manufacturer: EPCOS; Manufacturer Part Number: B32529C6103K000; Voltage: 400VDC/200VAC; Tolerance: ±10%; Table: Capacitors THD; Part Number: CPER_10NF_400V_10%_500-300X720X650; Component Kind: Standard; Component Type: Standard; Pin Count: 2; Value: 10nF; Status: None; Case: LS5 W3 x L7.2 x H6.5; Mounted: Yes; Socket: No; SMD: No; ComponentHeight: 6.5mm; HelpURL: \\cern.ch\dfs\Applications\Altium\Datasheets\CPER_EPCOS_B32529.pdf; Author: CERN DEM JLC; CreateDate: 23.03.2009; LatestRevisionDate: 23.03.2009
C25 C26 = CC0805_470NF_50V_10%_X7R: Non-polarised capacitor; Part Description: SMD Multilayer Chip Ceramic Capacitor; Manufacturer: GENERIC; Manufacturer1 Part Number: C0805C474K5RACTU; Voltage: 50V; TC: X7R; Tolerance: ±10%; Table: Capacitors SMD; Part Number: CC0805_470NF_50V_10%_X7R; Component Kind: Standard; Component Type: Standard; Pin Count: 2; Value: 470nF; Status: Preferred; Manufacturer Part Number: CC0805_470NF_50V_10%_X7R; Case: 0805; Mounted: Yes; Socket: No; SMD: Yes; Manufacturer1 Example: KEMET; Manufacturer1 ComponentHeight: 1.1mm; HelpURL: \\cern.ch\dfs\Applications\Altium\Datasheets\CC0805_X7R_KEMET.pdf; Author: CERN DEM JLC; CreateDate: 04.12.2013; LatestRevisionDate: 04.12.2013
C29 = WE-2.54 mm Pin Header & Jumper 61300411121: WR-PHD 2.54mm Pin Header; Manufacturer: WЁ№rth Elektronik eiSos GmbH; ComponentLink1 Description: Manufacturer; ComponentLink2 Description: Datasheet; NoPins: 04; Created Date: 22 March 2013; partNo: 61300411121; ComponentLink1URL: http://www.we-online.com; ComponentLink2URL: http://katalog.we-online.de/em/datasheet/6130xx11121.pdf; Created by: Karrer Zheng
D4 = LL4148: 75V 0.3A SOD80/MLL34; Price: 0.006
D5 D6 = BZV55-B3V6: Zener Diode; Part Description: Voltage Regulator Diode; Manufacturer: NXP SEMICONDUCTORS; Voltage: 3V6; Power: 500mW; Table: Diodes; Part Number: BZV55-B3V6; Component Kind: Standard; Component Type: Standard; Device: BZV55-B3V6; PackageDescription: SOD80C, MELF Diode, 2-Leads, Body 3.5x1.5mm, IPC Medium Density; Manufacturer Part Number: BZV55-B3V6; Pin Count: 2; Case: SOD-80C; Mounted: Yes; Socket: No; SMD: Yes; ComponentHeight: 1.6mm; HelpURL: \\cern.ch\dfs\Applications\Altium\Datasheets\BZV55.pdf; Author: CERN DEM JLC; CreateDate: 06.05.2008; LatestRevisionDate: 06.05.2008
FU1 = Fuse-PTF15: 5mm 6.3A; Price: 1
IC1 = LM7805CT_v: 3-Terminal Regulator 1=IN 2=GND 3=OUT; Part Description: 3-Terminal 5V 1A Positive Voltage Regulator; Manufacturer: FAIRCHILD SEMICONDUCTOR; Table: Regulators; Part Number: LM7805CT_v; Component Kind: Standard; Component Type: Standard; Device: LM7805CT; PackageDescription: TO-220 3-Terminal + Tab - Horizontal Mount; Manufacturer Part Number: LM7805CT; Pin Count: 3; Case: TO-220; Mounted: Yes; Socket: No; SMD: No; ComponentHeight: 18.95mm; HelpURL: \\cern.ch\dfs\Applications\Altium\Datasheets\LM7805CT.pdf; Author: CERN DEM JLC; CreateDate: 18.03.2008; LatestRevisionDate: 18.03.2008
IC2 = 4N25V: Single Optocoupler with Base; Part Description: Optocoupler, Phototransistor Output, With Base Connection; Manufacturer: VISHAY SEMICONDUCTORS; Manufacturer Part Number: 4N25V; Table: Optocouplers; Part Number: 4N35V; Component Kind: Standard; Component Type: Standard; Device: 4N35V; PackageDescription: DIP; 6 Leads; Row Spacing 7.62 mm; Pitch 2.54 mm; Pin Count: 6; Case: DIP6-300; Mounted: Yes; Socket: Yes; SMD: No; ComponentHeight: 4.6mm; HelpURL: \\cern.ch\dfs\Applications\Altium\Datasheets\4N25V.pdf; Author: CERN DEM JLC; CreateDate: 25.10.2012; LatestRevisionDate: 25.10.2012
J4 = 3M_N2516-6002RB: Connector 16 Male; Part Description: 16 Contacts - Straight .100'' x .100'' Low Profile Four-Wall Header, 2500 Series; Manufacturer: 3M; Part Number: 3M_N2516-6002RB; Component Kind: Standard; Component Type: Standard; Pin Count: 16; Family: Header 16; Mounted: Yes; Socket: No; SMD: No; Status: None; Manufacturer Part Number: N2516-6002RB; ComponentHeight: 10.03mm; HelpURL: \\cern.ch\dfs\Applications\Altium\Datasheets\3M_N2516-6002RB.pdf; Author: CERN DEM JLC; CreateDate: 11.02.2009; LatestRevisionDate: 11.08.2009; Table: 3M
J5 = MOLEX_22-27-2061: as J1 on sheet ControlBoard_p1; Part Number: MOLEX_22-27-2061; Component Kind: Standard; Component Type: Standard; Pin Count: 6; Family: KK®; Mounted: Yes; Socket: No; SMD: No; Status: None; Manufacturer Part Number: 22-27-2061; ComponentHeight: 11.7mm; HelpURL: \\cern.ch\dfs\Applications\Altium\Datasheets\MOLEX_22-27-2061.pdf; Author: CERN DEM JMW; CreateDate: 30.11.2011; LatestRevisionDate: 30.11.2011; Table: MOLEX
K1 K2 = TS-501 2P: 10A/300V AC 5mm; Price: 0.27
L1 = IND0805_WURTH_742792040: Inductor; Part Description: SMD EMI Suppression Chip Ferrite Bead (WE-CBF Serie); Manufacturer: WURTH ELEKTRONIK; Power: 2A; Resistance: 0.150R; Tolerance: ±25%; Table: Inductors SMD; Part Number: IND0805_WURTH_742792040; Component Kind: Standard; Component Type: Standard; Pin Count: 2; Value: 600R@100MHz; Status: None; Manufacturer Part Number: 742792040; Case: 0805; Mounted: Yes; Socket: No; SMD: Yes; ComponentHeight: 1.1mm; HelpURL: \\cern.ch\dfs\Applications\Altium\Datasheets\IND0805_WURTH_742792040.pdf; Author: CERN DEM JLC; CreateDate: 10.05.2010; LatestRevisionDate: 10.05.2010
LD1-LD5 = LED_OSRAM_LSR976: LED Red 1C 2A; Part Description: Surface Mount Super Red LED (0805 Case); Manufacturer: OSRAM; Manufacturer Part Number: LSR976; Table: LEDs & Displays; Part Number: LED_OSRAM_LSR976; Component Kind: Standard; Component Type: Standard; Color: Super Red; PackageDescription: Super Red Chip LED, 2-Leads, Body 2 x1.25mm, IPC Medium Density; Pin Count: 2; Case: 0805; Mounted: Yes; Socket: No; SMD: Yes; ComponentHeight: 0.9mm; HelpURL: \\cern.ch\dfs\Applications\Altium\Datasheets\LED_OSRAM_LSR976.pdf; Author: CERN DEM JLC; CreateDate: 18.05.2010; LatestRevisionDate: 18.05.2010
R17 R37 R38 = R0805_4K7_1%_0.125W_100PPM: as R4 on sheet ControlBoard_p1; Part Number: R0805_4K7_1%_0.125W_100PPM; Component Kind: Standard; Component Type: Standard; Pin Count: 2; Value: 4k7; Status: Preferred; Tolerance: ±1%; Manufacturer Part Number: R0805_4K7_1%_0.125W_100PPM; Case: 0805; Mounted: Yes; Socket: No; SMD: Yes; Manufacturer1 Example: NIC COMPONENT; Manufacturer1 ComponentHeight: 0.6mm; HelpURL: \\cern.ch\dfs\Applications\Altium\Datasheets\R0805_NIC_NRC.pdf; Author: CERN DEM JLC; CreateDate: 03.12.2007; LatestRevisionDate: 13.03.2008
R18 R21 = RMF_220K_1%_0.6W_50PPM_1016-630X250: Resistor - 1%; Part Description: Leaded Metal Film Resistor; Manufacturer: GENERIC; Manufacturer1 Part Number: MBB02070C2203FCT00; Power: 0.6W; TC: ±50ppm/°C; Table: Resistors THD; Part Number: RMF_220K_1%_0.6W_50PPM_1016-630X250; Component Kind: Standard; Component Type: Standard; Pin Count: 2; Value: 220k; Status: Preferred; Tolerance: ±1%; Manufacturer Part Number: RMF_220K_1%_0.6W_50PPM_1016-630X250; Case: LS10.16 L6.3 x D2.5; Mounted: Yes; Socket: No; SMD: No; ComponentHeight: 2.5mm; Manufacturer1 Example: VISHAY BEYSCHLAG; Manufacturer1 ComponentHeight: 2.5mm; HelpURL: \\cern.ch\dfs\Applications\Altium\Datasheets\RMF_VISHAY_MBB0207.pdf; Author: CERN DEM JLC; CreateDate: 04.12.2007; LatestRevisionDate: 07.04.2008
R19 = R0805_22K_1%_0.125W_100PPM: Resistor - 1%; Part Description: General Purpose Thick Film Chip Resistor; Manufacturer: GENERIC; Manufacturer1 Part Number: NRC10F2202TRF; Power: 0.125W; TC: ±100ppm/°C; Table: Resistors SMD; Part Number: R0805_22K_1%_0.125W_100PPM; Component Kind: Standard; Component Type: Standard; Pin Count: 2; Value: 22k; Status: Preferred; Tolerance: ±1%; Manufacturer Part Number: R0805_22K_1%_0.125W_100PPM; Case: 0805; Mounted: Yes; Socket: No; SMD: Yes; Manufacturer1 Example: NIC COMPONENT; Manufacturer1 ComponentHeight: 0.6mm; HelpURL: \\cern.ch\dfs\Applications\Altium\Datasheets\R0805_NIC_NRC.pdf; Author: CERN DEM JLC; CreateDate: 03.12.2007; LatestRevisionDate: 13.03.2008
R20 R26 R27 R32-R34 = R0805_100R_1%_0.125W_100PPM: Resistor - 1%; Part Description: General Purpose Thick Film Chip Resistor; Manufacturer: GENERIC; Manufacturer1 Part Number: NRC10F4700TRF; Power: 0.125W; TC: ±100ppm/°C; Table: Resistors SMD; Part Number: R0805_100R_1%_0.125W_100PPM; Component Kind: Standard; Component Type: Standard; Pin Count: 2; Value: 100; Status: Preferred; Tolerance: ±1%; Manufacturer Part Number: R0805_100R_1%_0.125W_100PPM; Case: 0805; Mounted: Yes; Socket: No; SMD: Yes; Manufacturer1 Example: NIC COMPONENT; Manufacturer1 ComponentHeight: 0.6mm; HelpURL: \\cern.ch\dfs\Applications\Altium\Datasheets\R0805_NIC_NRC.pdf; Author: CERN DEM JLC; CreateDate: 03.12.2007; LatestRevisionDate: 13.03.2008
R22 R23 = R0805_2K7_1%_0.125W_100PPM: Resistor - 1%; Part Description: General Purpose Thick Film Chip Resistor; Manufacturer: GENERIC; Manufacturer1 Part Number: NRC10F2701TRF; Power: 0.125W; TC: ±100ppm/°C; Table: Resistors SMD; Part Number: R0805_2K7_1%_0.125W_100PPM; Component Kind: Standard; Component Type: Standard; Pin Count: 2; Value: 2k7; Status: Preferred; Tolerance: ±1%; Manufacturer Part Number: R0805_2K7_1%_0.125W_100PPM; Case: 0805; Mounted: Yes; Socket: No; SMD: Yes; Manufacturer1 Example: NIC COMPONENT; Manufacturer1 ComponentHeight: 0.6mm; HelpURL: \\cern.ch\dfs\Applications\Altium\Datasheets\R0805_NIC_NRC.pdf; Author: CERN DEM JLC; CreateDate: 08.06.2010; LatestRevisionDate: 08.06.2010
R24 R25 = R0805_10K_1%_0.125W_100PPM: as R11 on sheet ControlBoard_p1; Part Number: R0805_10K_1%_0.125W_100PPM; Component Kind: Standard; Component Type: Standard; Pin Count: 2; Value: 10k; Status: Preferred; Tolerance: ±1%; Manufacturer Part Number: R0805_10K_1%_0.125W_100PPM; Case: 0805; Mounted: Yes; Socket: No; SMD: Yes; Manufacturer1 Example: NIC COMPONENT; Manufacturer1 ComponentHeight: 0.6mm; HelpURL: \\cern.ch\dfs\Applications\Altium\Datasheets\R0805_NIC_NRC.pdf; Author: CERN DEM JLC; CreateDate: 03.12.2007; LatestRevisionDate: 13.03.2008
R28 R30 = R0805_1K2_1%_0.125W_100PPM: Resistor - 1%; Part Description: General Purpose Thick Film Chip Resistor; Manufacturer: GENERIC; Manufacturer1 Part Number: NRC10F1201TRF; Power: 0.125W; TC: ±100ppm/°C; Table: Resistors SMD; Part Number: R0805_1K2_1%_0.125W_100PPM; Component Kind: Standard; Component Type: Standard; Pin Count: 2; Value: 1k2; Status: Preferred; Tolerance: ±1%; Manufacturer Part Number: R0805_1K2_1%_0.125W_100PPM; Case: 0805; Mounted: Yes; Socket: No; SMD: Yes; Manufacturer1 Example: NIC COMPONENT; Manufacturer1 ComponentHeight: 0.6mm; HelpURL: \\cern.ch\dfs\Applications\Altium\Datasheets\R0805_NIC_NRC.pdf; Author: CERN DEM JLC; CreateDate: 03.12.2007; LatestRevisionDate: 13.03.2008
R29 R31 = R0805_5K6_1%_0.125W_100PPM: Resistor - 1%; Part Description: General Purpose Thick Film Chip Resistor; Manufacturer: GENERIC; Manufacturer1 Part Number: NRC10F5601TRF; Power: 0.125W; TC: ±100ppm/°C; Table: Resistors SMD; Part Number: R0805_5K6_1%_0.125W_100PPM; Component Kind: Standard; Component Type: Standard; Pin Count: 2; Value: 5k6; Status: Preferred; Tolerance: ±1%; Manufacturer Part Number: R0805_5K6_1%_0.125W_100PPM; Case: 0805; Mounted: Yes; Socket: No; SMD: Yes; Manufacturer1 Example: NIC COMPONENT; Manufacturer1 ComponentHeight: 0.6mm; HelpURL: \\cern.ch\dfs\Applications\Altium\Datasheets\R0805_NIC_NRC.pdf; Author: CERN DEM JLC; CreateDate: 03.12.2007; LatestRevisionDate: 13.03.2008
R35 R36 = R0805_2K32_0.1%_0.1W_10PPM: Resistor - 0.1%; Part Description: Thin Film Chip Resistor; Manufacturer: GENERIC; Manufacturer1 Part Number: RN73C2A2K32BTG; Power: 0.1W; TC: ±10ppm; Table: Resistors SMD; Part Number: R0805_2K32_0.1%_0.1W_10PPM; Component Kind: Standard; Component Type: Standard; Pin Count: 2; Value: 2k32; Status: Not recommended; Tolerance: ±0.1%; Manufacturer Part Number: R0805_2K32_0.1%_0.1W_10PPM; Case: 0805; Mounted: Yes; Socket: No; SMD: Yes; Manufacturer1 Example: TYCO HOLSWORTHY; Manufacturer1 ComponentHeight: 0.6mm; HelpURL: \\cern.ch\dfs\Applications\Altium\Datasheets\R0805_Tyco_RN73.pdf; Author: CERN DEM JLC; CreateDate: 03.12.2007; LatestRevisionDate: 13.03.2008
R39 R41-R43 = R0805_330R_1%_0.125W_100PPM: Resistor - 1%; Part Description: General Purpose Thick Film Chip Resistor; Manufacturer: GENERIC; Manufacturer1 Part Number: NRC10F3300TRF; Power: 0.125W; TC: ±100ppm/°C; Table: Resistors SMD; Part Number: R0805_330R_1%_0.125W_100PPM; Component Kind: Standard; Component Type: Standard; Pin Count: 2; Value: 330; Status: Preferred; Tolerance: ±1%; Manufacturer Part Number: R0805_330R_1%_0.125W_100PPM; Case: 0805; Mounted: Yes; Socket: No; SMD: Yes; Manufacturer1 Example: NIC COMPONENT; Manufacturer1 ComponentHeight: 0.6mm; HelpURL: \\cern.ch\dfs\Applications\Altium\Datasheets\R0805_NIC_NRC.pdf; Author: CERN DEM JLC; CreateDate: 03.12.2007; LatestRevisionDate: 13.03.2008
R40 = R0805_47K_1%_0.125W_100PPM: as R1 on sheet ControlBoard_p1; Part Number: R0805_47K_1%_0.125W_100PPM; Component Kind: Standard; Component Type: Standard; Pin Count: 2; Value: 47k; Status: Preferred; Tolerance: ±1%; Manufacturer Part Number: R0805_47K_1%_0.125W_100PPM; Case: 0805; Mounted: Yes; Socket: No; SMD: Yes; Manufacturer1 Example: NIC COMPONENT; Manufacturer1 ComponentHeight: 0.6mm; HelpURL: \\cern.ch\dfs\Applications\Altium\Datasheets\R0805_NIC_NRC.pdf; Author: CERN DEM JLC; CreateDate: 03.12.2007; LatestRevisionDate: 13.03.2008
T2 = MMBT3904: NPN Transistor; Part Description: 40V 200mA NPN Switching Transistor; Manufacturer: NXP SEMICONDUCTORS; Table: Transistors; Part Number: MMBT3904; Component Kind: Standard; Component Type: Standard; Device: MMBT3904; PackageDescription: SOT23, 3 pin, Pitch 0.95mm - 1.3mm W X 2.9mm L X 1.1mm H, IPC Medium Density; Manufacturer Part Number: MMBT3904; Pin Count: 3; Case: SOT23-3; Mounted: Yes; Socket: No; SMD: Yes; ComponentHeight: 1.1mm; HelpURL: \\cern.ch\dfs\Applications\Altium\Datasheets\MMBT3904.pdf; Author: CERN DEM JLC; CreateDate: 10.02.2010; LatestRevisionDate: 10.02.2010
T3 T4 = BC817: NPN Transistor; Part Description: 45V 500mA NPN General-Purpose Transistor; Manufacturer: NXP SEMICONDUCTORS; Table: Transistors; Part Number: BC817; Component Kind: Standard; Component Type: Standard; Device: BC817; PackageDescription: SOT23, 3 pin, Pitch 0.95mm - 1.3mm W X 2.9mm L X 1.1mm H, IPC Medium Density; Manufacturer Part Number: BC817; Pin Count: 3; Case: SOT23-3; Mounted: Yes; Socket: No; SMD: Yes; ComponentHeight: 1.1mm; HelpURL: \\cern.ch\dfs\Applications\Altium\Datasheets\BC817.pdf; Author: CERN DEM JLC; CreateDate: 12.05.2011; LatestRevisionDate: 12.05.2011
U4 = UA78L02ACLP: Fixed Regulator with 4.75 to 20 V Input and 2.6 V Output, 0 to 125 degC, 3-Pin TO-92 (LP), Pb-Free (RoHS); Manufacturer: Texas Instruments; Iout(Max)(A): 0.1; Iq(Typ)(mA): 6; Vin(Max)(V): 20; Vin(Min)(V): 4.75; Vout(Max)(V): 2.6; DatasheetVersion: SLVS010S; PackageVersion: revC, Oct-2001; PackageReference: LP3; PackageDescription: Plastic Cylindrical Package, Formed Lead Option (TO-92); Supplier 1: Digi-Key; Supplier Part Number 1: 296-11117-5-ND; Supplier 2: Newark; Supplier Part Number 2: 14P7576; Supplier 3: Mouser; Supplier Part Number 3: 595-UA78L02ACLP; Eco-Plan: Pb-Free (RoHS); Vout(Min)(V): 2.6; Mounting Technology: Through Hole; Code_JEDEC: TO-226-AA; PartNumber: UA78L02ACLP; ComponentLink1Description: Datasheet; ComponentLink1URL: http://www.ti.com/general/docs/lit/getliterature.tsp?genericPartNumber=UA78L02A&fileType=pdf; ComponentLink2Description: Package Specification; ComponentLink2URL: http://www.ti.com/litv/pdf/msot002a; ComponentLink3Description: URL Link1; ComponentLink3URL: Samples URL:http://www.ti.com/product/ua78l02a#samples
U5 = ADUM1201ARZ: Dual Channel Digital Isolator, 2.5 KV rms Insulation Rating, 1 Mbps Data Rate, 150 ns Delay, Industrial, 8-pin SOIC (R-8), Tube; Manufacturer: Analog Devices; Insulation Rating (kVrms): 2.5; Max Data Rate: 1Mbps; DatasheetVersion: Rev. I; PackageVersion: 060506-A, 06/2006; PackageReference: R-8; PackageDescription: 8-Pin Standard Small Outline Package, Body 4.9 x 3.9 mm, Pitch 1.27 mm; Supplier 1: Digi-Key; Supplier Part Number 1: ADUM1201ARZ-ND; Supplier 2: Farnell; Supplier Part Number 2: 1078200; Supplier 3: Mouser; Supplier Part Number 3: 584-ADUM1201ARZ; Max Operating Temp (degreesC): 125; Mounting Technology: Surface Mount; Code_JEDEC: MS-012-AA; PartNumber: ADUM1201ARZ; ComponentLink1Description: Manufacturer URL; ComponentLink1URL: http://www.analog.com/en/index.html; ComponentLink2Description: Datasheet; ComponentLink2URL: http://www.analog.com/static/imported-files/data_sheets/ADuM1200_1201.pdf; ComponentLink3Description: Package Specification; ComponentLink3URL: http://www.analog.com/static/imported-files/packages/PKG_PDF/SOIC_Narrow%20(R)/R_8.pdf; ComponentLink4Description: URL Link1; ComponentLink4URL: Product URL:http://www.analog.com/en/interface-isolation/digital-isolators/adum1201/products/product.html; ComponentLink5Description: URL Link2; ComponentLink5URL: Reference Circuit:http://www.analog.com/en/interface-isolation/digital-isolators/adum1201/products/product.html#product-recommendations
Vr1 = Var 7K391: Варистор 7mm; Price: 0.1
DA1 DA2 = LTV817: Price: 0.28

## Nets that join several sheets
+3V3: ControlBoard_p1 (24 pins), ControlBoard_p2 (9 pins)
+3V3A: ControlBoard_p1 (C8.2 U2.9), ControlBoard_p2 (C17.2 C18.1 L1.1 U4.1)
GND: ControlBoard_p1 (33 pins), ControlBoard_p2 (32 pins)
NetC25_2: ControlBoard_p1 (U2.11), ControlBoard_p2 (C25.2 R29.2)
NetC26_2: ControlBoard_p1 (U2.10), ControlBoard_p2 (C26.2 R31.2)
NetC29_2: ControlBoard_p1 (U2.31), ControlBoard_p2 (C29.2 U5.2)
NetC29_3: ControlBoard_p1 (U2.30), ControlBoard_p2 (C29.3 R40.1 U5.3)
NetDA1_4: ControlBoard_p1 (H1.1 U2.33 U3.4), ControlBoard_p2 (DA1.4 R37.1)
NetIC2_5: ControlBoard_p1 (U2.4), ControlBoard_p2 (IC2.5 R17.1)
NetJ4_8: ControlBoard_p1 (R11.1 U2.29), ControlBoard_p2 (J4.8)
NetLD1_2: ControlBoard_p1 (U2.43), ControlBoard_p2 (LD1.2)
NetLD2_2: ControlBoard_p1 (U2.42), ControlBoard_p2 (LD2.2)
NetLD3_2: ControlBoard_p1 (U2.41), ControlBoard_p2 (LD3.2)
NetLD4_2: ControlBoard_p1 (U2.40), ControlBoard_p2 (LD4.2)
NetLD5_2: ControlBoard_p1 (U2.39), ControlBoard_p2 (LD5.2)
NetR22_2: ControlBoard_p1 (U2.27), ControlBoard_p2 (R22.2)
NetR23_2: ControlBoard_p1 (U3.6), ControlBoard_p2 (R23.2)
NetR39_2: ControlBoard_p1 (U2.32 U3.1 U3.2), ControlBoard_p2 (R39.2)